# Altium schematic sheet PA93_PCBSCH.SchDoc
size A4
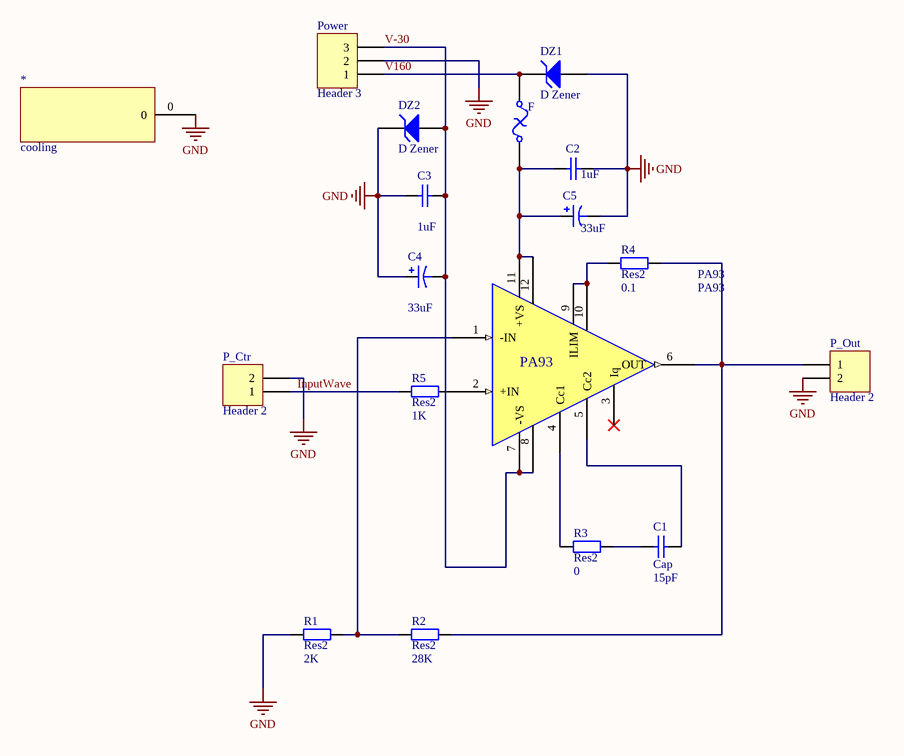
[diagram p0: PA93_PCBSCH.SchDoc]

## Parts
*  cooling  [cooling]
C1  Cap  value 15pF  [1206]
C2  value 1uF  [1812]  (hidden comment: Cap)
C3  value 1uF  [1812]  (hidden comment: Cap)
C4  value 33uF  [RB7.6-15]  (hidden comment: Cap Pol1)
C5  value 33uF  [RB7.6-15]  (hidden comment: Cap Pol1)
DZ1  D Zener  [DO-15]
DZ2  D Zener  [DO-15]
F  Fuse Thermal  [PIN-W2/E2.8]  (value not drawn)
P_Ctr  Header 2  [JK128-500-2p]
P_Out  Header 2  [jk128-500-2p]
PA93  PA93  [HDR1X12]
Power  Header 3  [jk128-500-3p]
R1  Res2  value 2K  [AXIAL-0.15]
R2  Res2  value 28K  [AXIAL-0.15]
R3  Res2  value 0  [1206]
R4  Res2  value 0.1  [axial0.4]
R5  Res2  value 1K  [AXIAL-0.15]

## Nets
GND: *.0 C2.2 C3.1 C4.1 C5.2 DZ1.1(A) DZ2.2(K) P_Ctr.2 P_Out.2 Power.2 R1.1
InputWave: P_Ctr.1 R5.1
V160: DZ1.2(K) F.2 Power.1
V-30: C3.2 C4.2 DZ2.1(A) PA93.7(-VS) PA93.8(-VS) Power.3
NetC1_1: C1.1 R3.2
NetC1_2: C1.2 PA93.5(Cc2)
NetC2_1: C2.1 C5.1 F.1 PA93.11(+VS) PA93.12(+VS)
NetP_Out_1: P_Out.1 PA93.6(OUT) R2.2 R4.2
NetPA93_1: PA93.1(-IN) R1.2 R2.1
NetPA93_2: PA93.2(+IN) R5.2
NetPA93_4: PA93.4(Cc1) R3.1
NetPA93_9: PA93.9(ILIM) PA93.10(ILIM) R4.1

Not connected (* = marked no-connect by the designer): PA93 3(Iq)*

## Library data of the parts
C1-C3 = Cap: Capacitor; Published: 8-Jun-2000; LatestRevisionDate: 17-Jul-2002; LatestRevisionNote: Re-released for DXP Platform.; PackageReference: RAD-0.3; Publisher: Altium Limited; PackageDescription: Radial Cap, Thru-Hole; 2 Leads; 0.3 in Pin Spacing
C4 C5 = Cap Pol1: Polarized Capacitor (Radial); Published: 8-Jun-2000; LatestRevisionDate: 17-Jul-2002; LatestRevisionNote: Re-released for DXP Platform.; PackageReference: RB7.6-15; Publisher: Altium Limited; PackageDescription: Polarized Capacitor (Radial); 2 Leads
DZ1 DZ2 = D Zener: Zener Diode; pin to pad: 1>A 2>K; Published: 8-Jun-2000; LatestRevisionDate: 17-Jul-2002; LatestRevisionNote: Re-released for DXP Platform.; PackageReference: DIODE-0.7; Publisher: Altium Limited; PackageDescription: Diode, Thru-Hole; 2 Leads; 0.7 in Pin Spacing
F = Fuse Thermal: Thermal Fuse; Published: 24-Mar-1999; LatestRevisionDate: 17-Jul-2002; LatestRevisionNote: Re-released for DXP Platform.; PackageReference: PIN-W2/E2.8; Publisher: Altium Limited; PackageDescription: Thru-Hole; 2 Leads
P_Ctr P_Out = Header 2: Header, 2-Pin; LatestRevisionDate: 17-Jul-2002; LatestRevisionNote: Re-released for DXP Platform.; Publisher: Altium Limited
Power = Header 3: Header, 3-Pin; LatestRevisionDate: 17-Jul-2002; LatestRevisionNote: Re-released for DXP Platform.; Publisher: Altium Limited
R1-R5 = Res2: Resistor; Published: 8-Jun-2000; LatestRevisionDate: 17-Jul-2002; LatestRevisionNote: Re-released for DXP Platform.; PackageReference: AXIAL-0.4; Publisher: Altium Limited; PackageDescription: Axial Device, Thru-Hole; 2 Leads; 0.4 in Pin Spacing